# EasyEDA Pro project EPDSchedule.eprj

# Schematic Schematic1
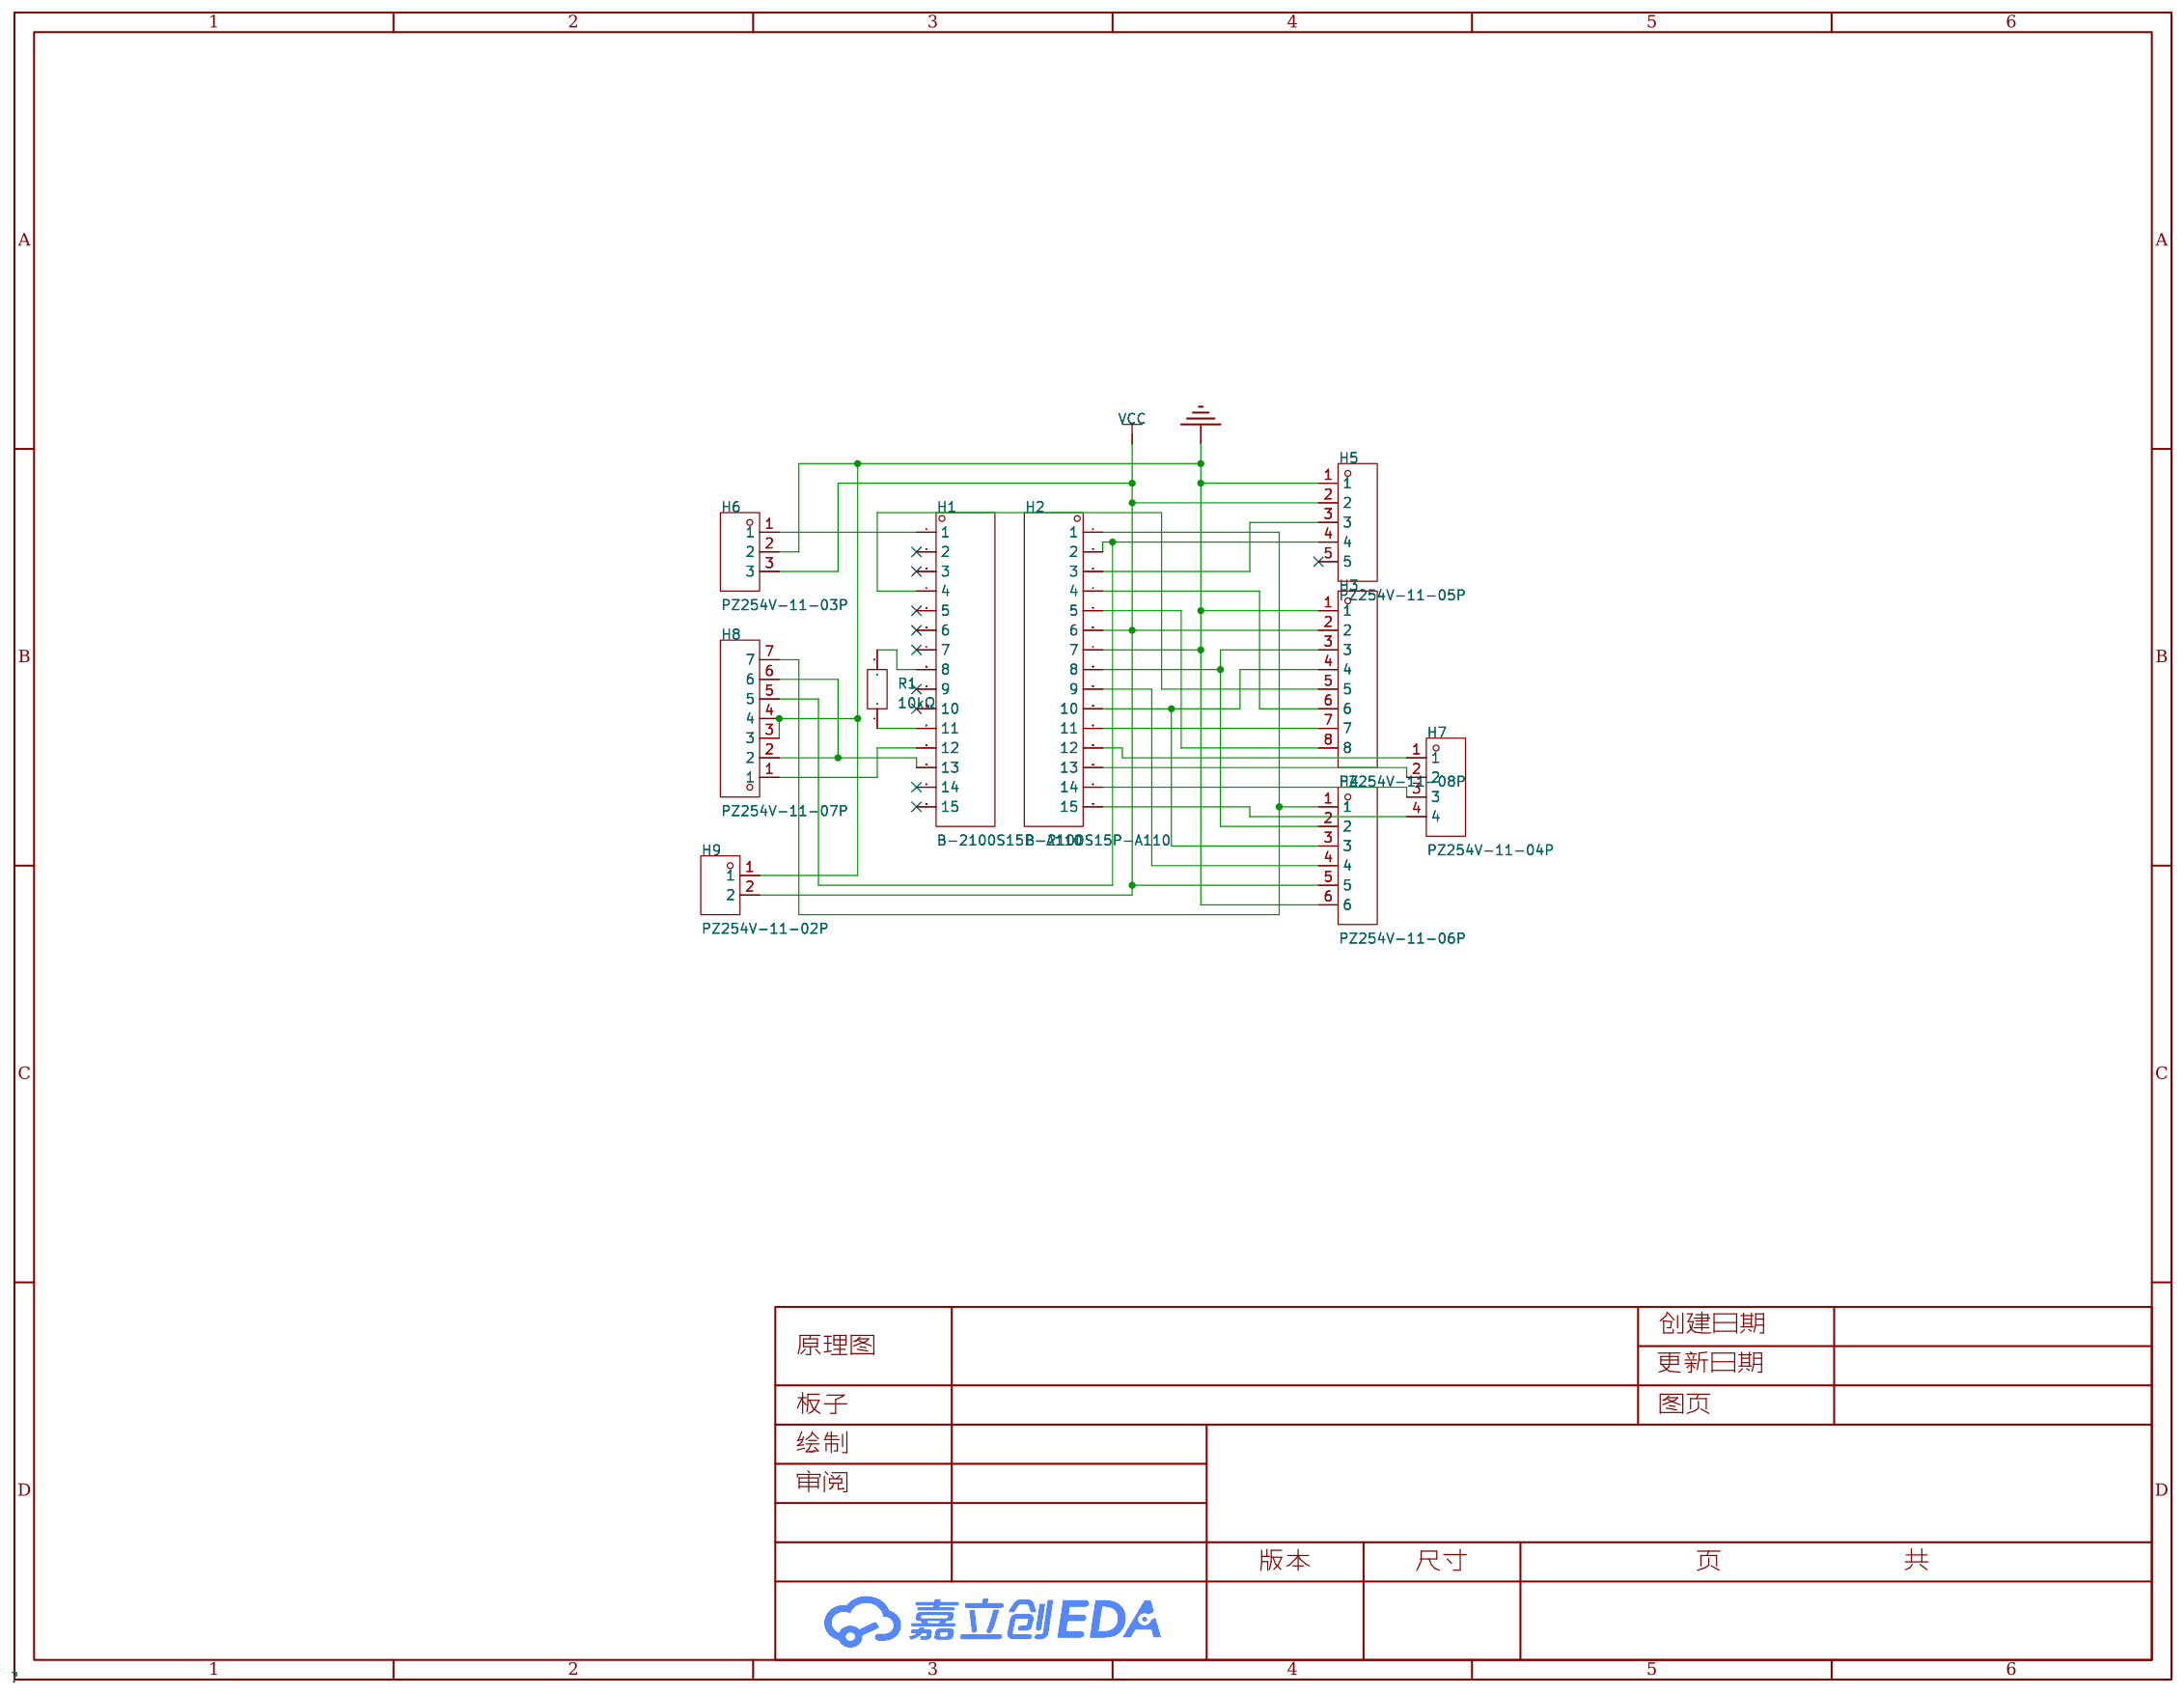
[diagram p0: schematic sheet]

## Parts
H1  B-2100S15P-A110  [HDR-TH_15P-P2.54-V-M]
H2  B-2100S15P-A110  [HDR-TH_15P-P2.54-V-M]
H3  PZ254V-11-08P  [HDR-TH_8P-P2.54-V-M]
H4  PZ254V-11-06P  [HDR-TH_6P-P2.54-V-M]
H5  PZ254V-11-05P  [HDR-TH_5P-P2.54-V-M]
H6  PZ254V-11-03P  [HDR-TH_3P-P2.54-V-M]
H7  PZ254V-11-04P  [HDR-TH_4P-P2.54-V-M]
H8  PZ254V-11-07P  [HDR-TH_7P-P2.54-V-M]
H9  PZ254V-11-02P  [HDR-TH_2P-P2.54-V-M]
R1  10kΩ  [RES-TH_BD2.4-L6.3-P10.30-D0.6]

## Library data of the parts
H1 H2 = B-2100S15P-A110: LCSC Part Name: 2.54mm 1x15P 直插; Supplier Part: C124373; Manufacturer: Ckmtw(灿科盟); Supplier Footprint: 插件,P=2.54mm; JLCPCB Part Class: Extended Part; Datasheet: https://atta.szlcsc.com/upload/public/pdf/source/20170821/C124373_1503303304753901525.pdf; Supplier: LCSC; Pitch: 2.54mm; Number of Pins: 15; Number of Rows: 1; Pin Structure: 1x15P; Mounting Type: 直插; Length of Mating Pin: 6mm; Insulation Height: 2.54mm; Length of End Connection Pin: 3mm; Contact Material: 黄铜; Operating Temperature Range: -40℃~+105℃; Color: 黑色
H3 = PZ254V-11-08P: LCSC Part Name: 2.54mm 1x8P 直插 方针; Supplier Part: C492407; Manufacturer: XFCN(兴飞); Supplier Footprint: 插件,P=2.54mm; JLCPCB Part Class: Extended Part; Datasheet: https://atta.szlcsc.com/upload/public/pdf/source/20200309/C492407_83A6FB26A2233368EDB9516968EC6149.pdf; Supplier: LCSC; Pitch: 2.54mm; Number of Pins: 8; Number of Rows: 1; Pin Structure: 1x8P; Mounting Type: 直插; Circluar Pins/Square Pins: 方针; Length of Mating Pin: 6mm; Insulation Height: 2.5mm; Length of End Connection Pin: 3mm; Contact Material: 黄铜; Operating Temperature Range: -40℃~+105℃; Color: 黑色
H4 = PZ254V-11-06P: LCSC Part Name: 间距:2.54mm 1x6P 直插 方针; Supplier Part: C492405; Manufacturer: XFCN(兴飞); Supplier Footprint: 插件,P=2.54mm; JLCPCB Part Class: 扩展库; Datasheet: https://atta.szlcsc.com/upload/public/pdf/source/20200309/C492405_597F1930F5B55CC3C7FD95458F1C3977.pdf; Supplier: LCSC; Pin Structure: 1x6P; Pitch: 2.54mm; Circluar Pins/Square Pins: 方针; Mounting Type: 直插; Number of Rows: 单排; Number of Pins: 6P; Length of Mating Pin: 6mm; Insulation Height: 2.5mm; Length of End Connection Pin: 3mm; Contact Material: 黄铜; Operating Temperature Range: -40℃~+105℃; Color: 黑色
H5 = PZ254V-11-05P: LCSC Part Name: 2.54mm 1x5P 直插 方针; Supplier Part: C492404; Manufacturer: XFCN(兴飞); Supplier Footprint: 直插,P=2.54mm; JLCPCB Part Class: Extended Part; Datasheet: https://atta.szlcsc.com/upload/public/pdf/source/20200309/C492404_E51533260F8710EFF5D4617281164C1D.pdf; Supplier: LCSC; Pitch: 2.54mm; Number of Pins: 5; Number of Rows: 1; Pin Structure: 1x5P; Mounting Type: 直插; Circluar Pins/Square Pins: 方针; Length of Mating Pin: 6mm; Insulation Height: 2.5mm; Length of End Connection Pin: 3mm; Contact Material: 黄铜; Operating Temperature Range: -40℃~+105℃; Color: 黑色
H6 = PZ254V-11-03P: LCSC Part Name: 2.54mm 1x3P 直插 方针; Supplier Part: C492402; Manufacturer: XFCN(兴飞); Supplier Footprint: 插件,P=2.54mm; JLCPCB Part Class: Extended Part; Datasheet: https://atta.szlcsc.com/upload/public/pdf/source/20200309/C492402_8335C3D49C4E4C618838D59BB1D024C1.pdf; Supplier: LCSC; Pitch: 2.54mm; Number of Pins: 3; Number of Rows: 1; Pin Structure: 1x3P; Mounting Type: 直插; Circluar Pins/Square Pins: 方针; Length of Mating Pin: 6mm; Insulation Height: 2.5mm; Length of End Connection Pin: 3mm; Contact Material: 黄铜; Operating Temperature Range: -40℃~+105℃; Color: 黑色
H7 = PZ254V-11-04P: LCSC Part Name: 间距:2.54mm 1x4P 直插 方针; Supplier Part: C2691448; Manufacturer: XFCN(兴飞); Supplier Footprint: 插件,P=2.54mm; JLCPCB Part Class: 扩展库; Datasheet: https://atta.szlcsc.com/upload/public/pdf/source/20200309/C492403_F9F19131791D08044AD4F84F8E751A34.pdf; Supplier: LCSC; Pin Structure: 1x4P; Pitch: 2.54mm; Circluar Pins/Square Pins: 方针; Mounting Type: 直插; Number of Rows: 单排; Number of Pins: 4P; Current Rating (Max): 3A; Voltage Rating (Max): 250V; Length of Mating Pin: 6mm; Insulation Height: 2.5mm; Length of End Connection Pin: 3mm; Operating Temperature Range: -40℃~+105℃; Color: 黑色
H8 = PZ254V-11-07P: LCSC Part Name: 2.54mm 1x7P 直插 方针; Supplier Part: C492406; Manufacturer: XFCN(兴飞); Supplier Footprint: 直插,P=2.54mm; JLCPCB Part Class: Extended Part; Datasheet: https://atta.szlcsc.com/upload/public/pdf/source/20200309/C492406_654C533EE691117E22DD9F76C114C2D9.pdf; Supplier: LCSC; Pitch: 2.54mm; Number of Pins: 7; Number of Rows: 1; Pin Structure: 1x7P; Mounting Type: 直插; Circluar Pins/Square Pins: 方针; Length of Mating Pin: 6mm; Insulation Height: 2.5mm; Length of End Connection Pin: 3mm; Contact Material: 黄铜; Operating Temperature Range: -40℃~+105℃; Color: 黑色
H9 = PZ254V-11-02P: LCSC Part Name: 间距:2.54mm 1x2P 直插 方针; Supplier Part: C492401; Manufacturer: XFCN(兴飞); Supplier Footprint: 插件,P=2.54mm; JLCPCB Part Class: 扩展库; Datasheet: https://atta.szlcsc.com/upload/public/pdf/source/20200309/C492401_A812433581A9B211A7FFA413ADDFF0E5.pdf; Supplier: LCSC; Pin Structure: 1x2P; Pitch: 2.54mm; Circluar Pins/Square Pins: 方针; Mounting Type: 直插; Number of Rows: 单排; Number of Pins: 2P; Length of Mating Pin: 6mm; Insulation Height: 2.5mm; Length of End Connection Pin: 3mm; Contact Material: 黄铜; Operating Temperature Range: -40℃~+105℃; Color: 黑色
R1 = RN1/4W10KFT/BA1: LCSC Part Name: 10kΩ ±1% 250mW 金属膜电阻; Supplier Part: C410695; Manufacturer: Tyohm(幸亚电阻); Supplier Footprint: 插件,D2.4xL6.5mm; JLCPCB Part Class: 扩展库; Datasheet: https://atta.szlcsc.com/upload/public/pdf/source/20190808/C410699_D126E64D28B638F1D73B58E9F61DFD9B.pdf; Supplier: LCSC; Type: 金属膜电阻; Tolerance: ±1%; Overload Voltage (Max): 250V; Power(Watts): 250mW; Temperature Coefficient: ±50ppm/℃; Operating Temperature Range: -55℃~+125℃

## Nets
GND: H2.7 H3.1 H4.6 H5.1 H6.2 H8.3 H8.4 H9.1
VCC: H2.6 H3.2 H4.5 H5.2 H6.3 H9.2
$1N870: H1.1 H6.1
$1N1333: H2.3 H5.3
$1N1339: H2.2 H5.4 H8.5
$1N1392: H2.8 H3.3 H4.2
$1N1398: H2.10 H3.4 H4.3
$1N1417: H1.4 H3.5
$1N1423: H2.4 H3.6
$1N1437: H2.11 H3.7
$1N1441: H2.5 H3.8
$1N1492: H2.9 H4.4
$1N1542: H2.1 H4.1 H8.7
$1N1650: H2.12 H7.1
$1N1656: H2.13 H7.2
$1N1669: H2.15 H7.4
$1N1864: H1.13 H8.2 H8.6
$1N1987: H1.8 R1.2
$1N1996: H1.11 R1.1
$1N2072: H1.12 H8.1
Net-(H2-14): H2.14 H7.3

Not connected (* = marked no-connect by the designer): H1 2* 3* 5* 6* 7* 9* 10* 14* 15*; H5 5*

# Board PCB1
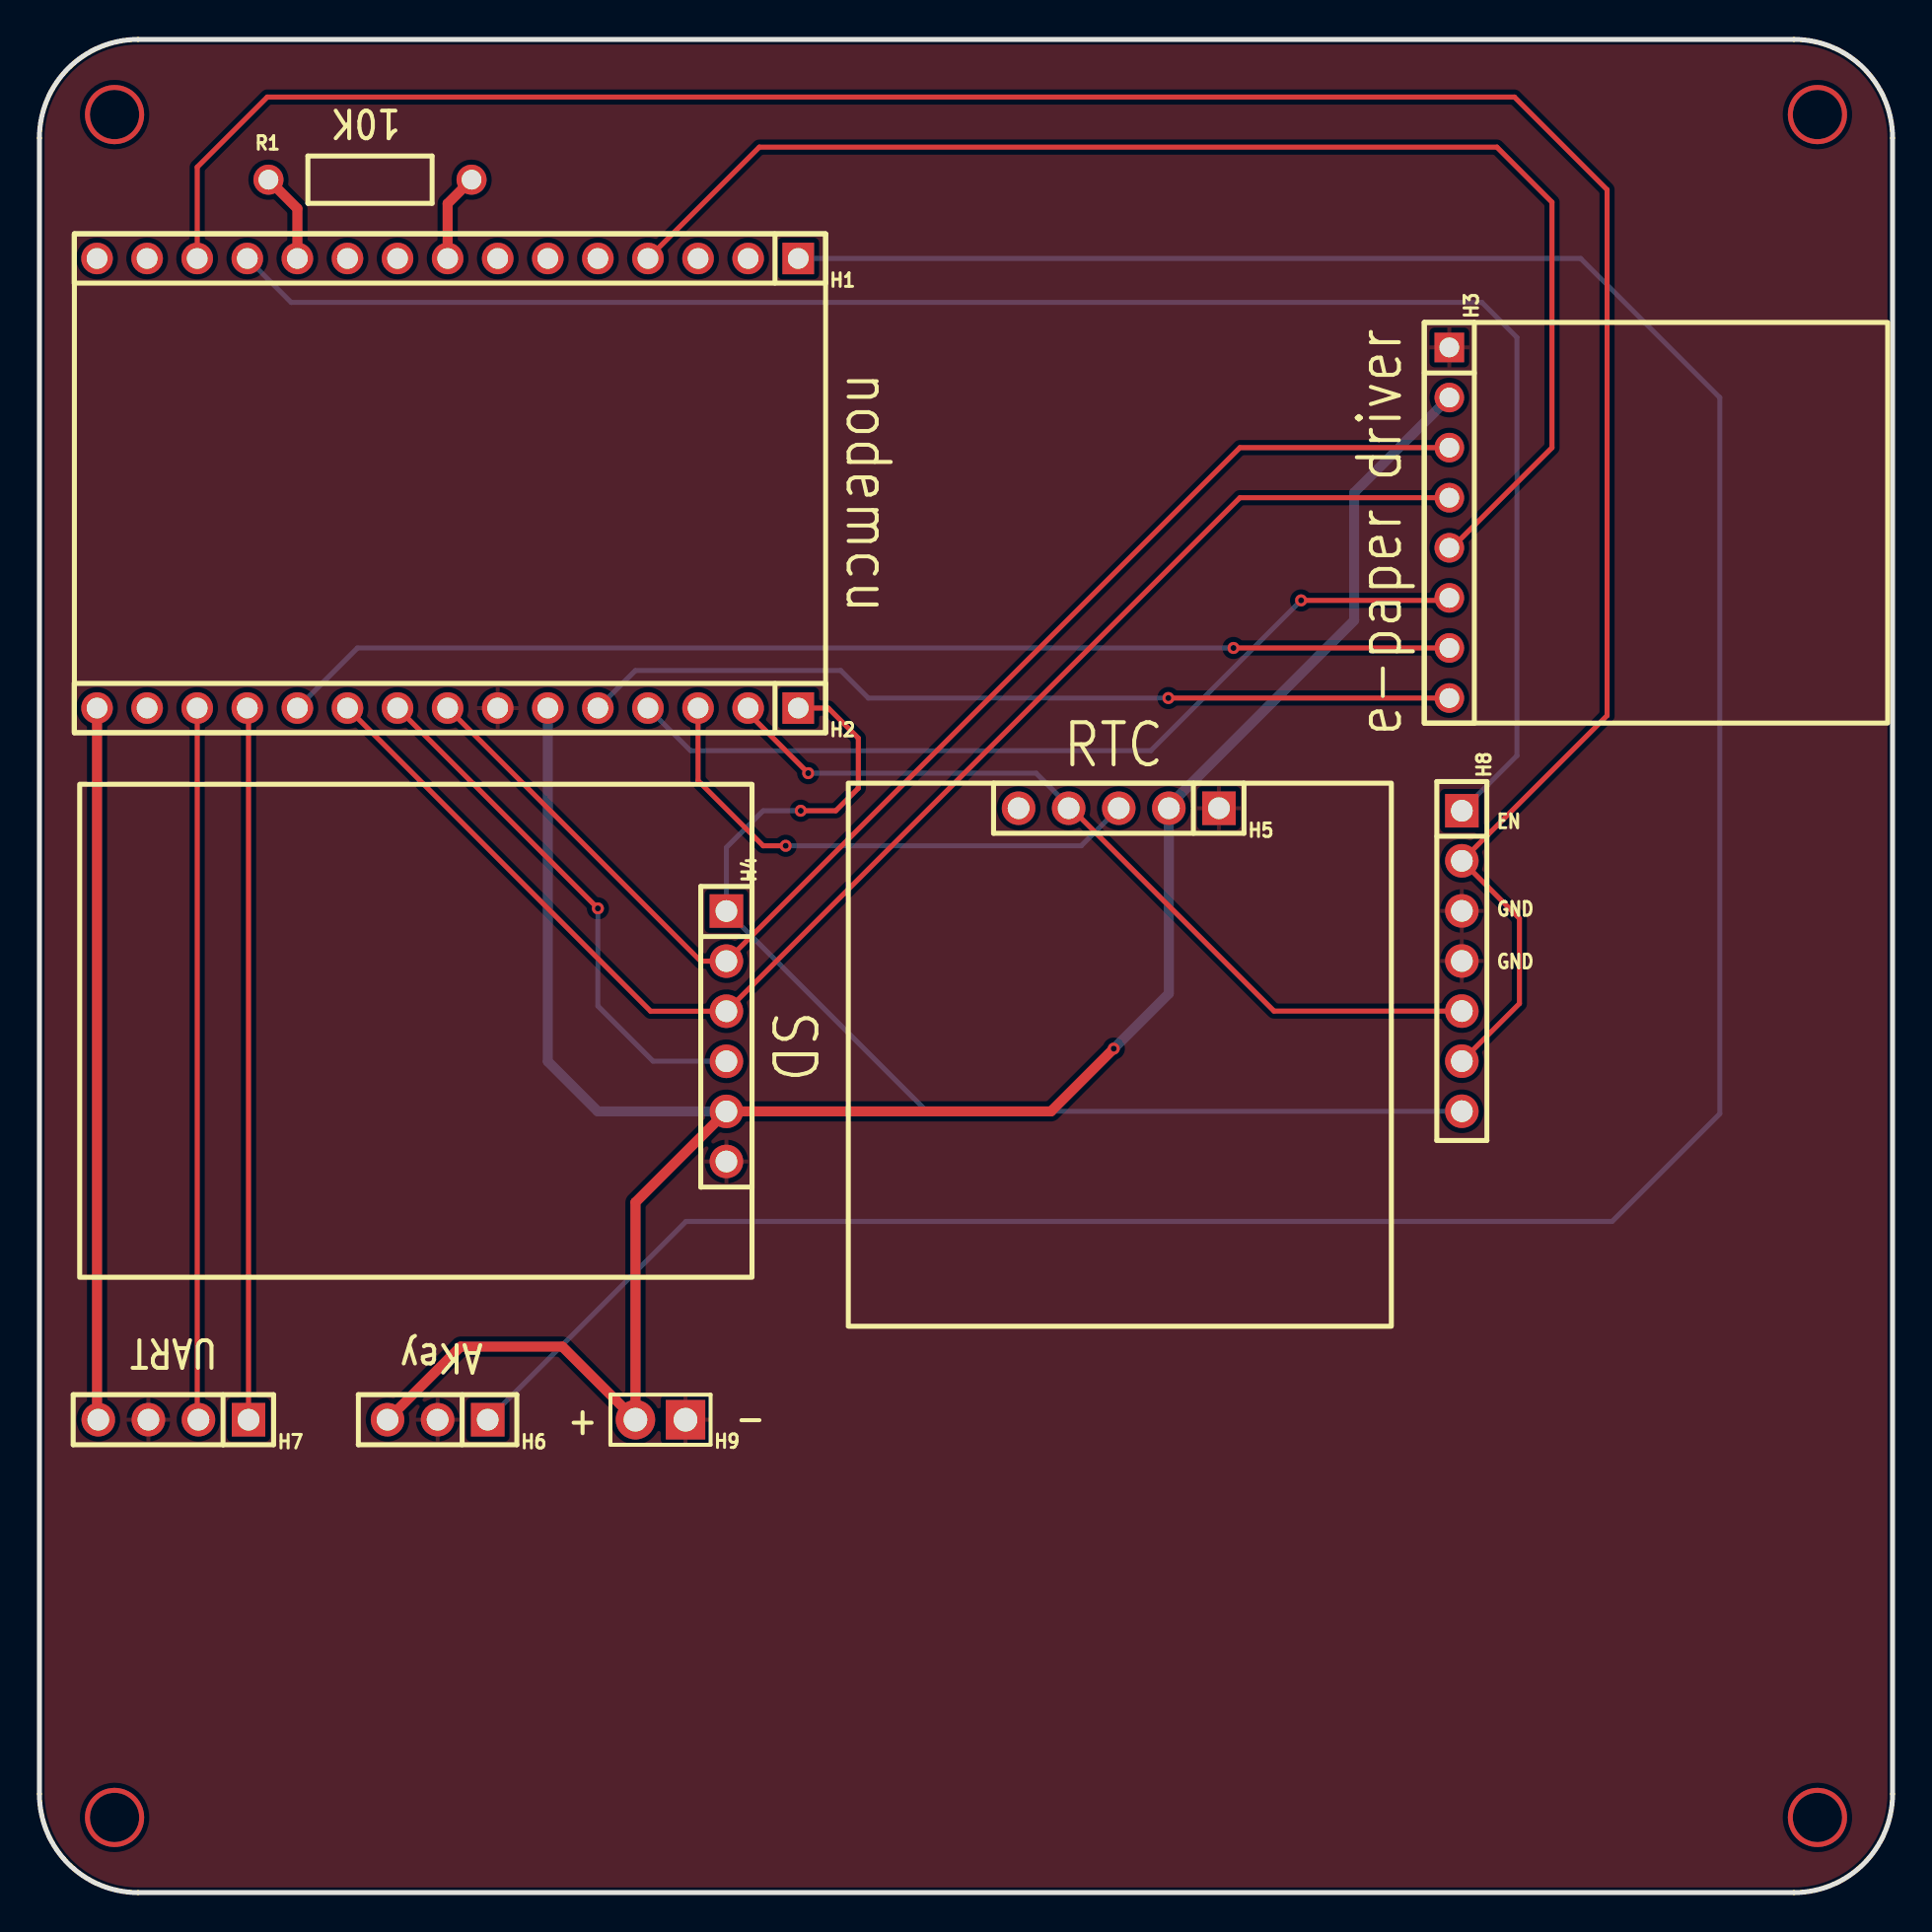
[diagram p1: board, top side]
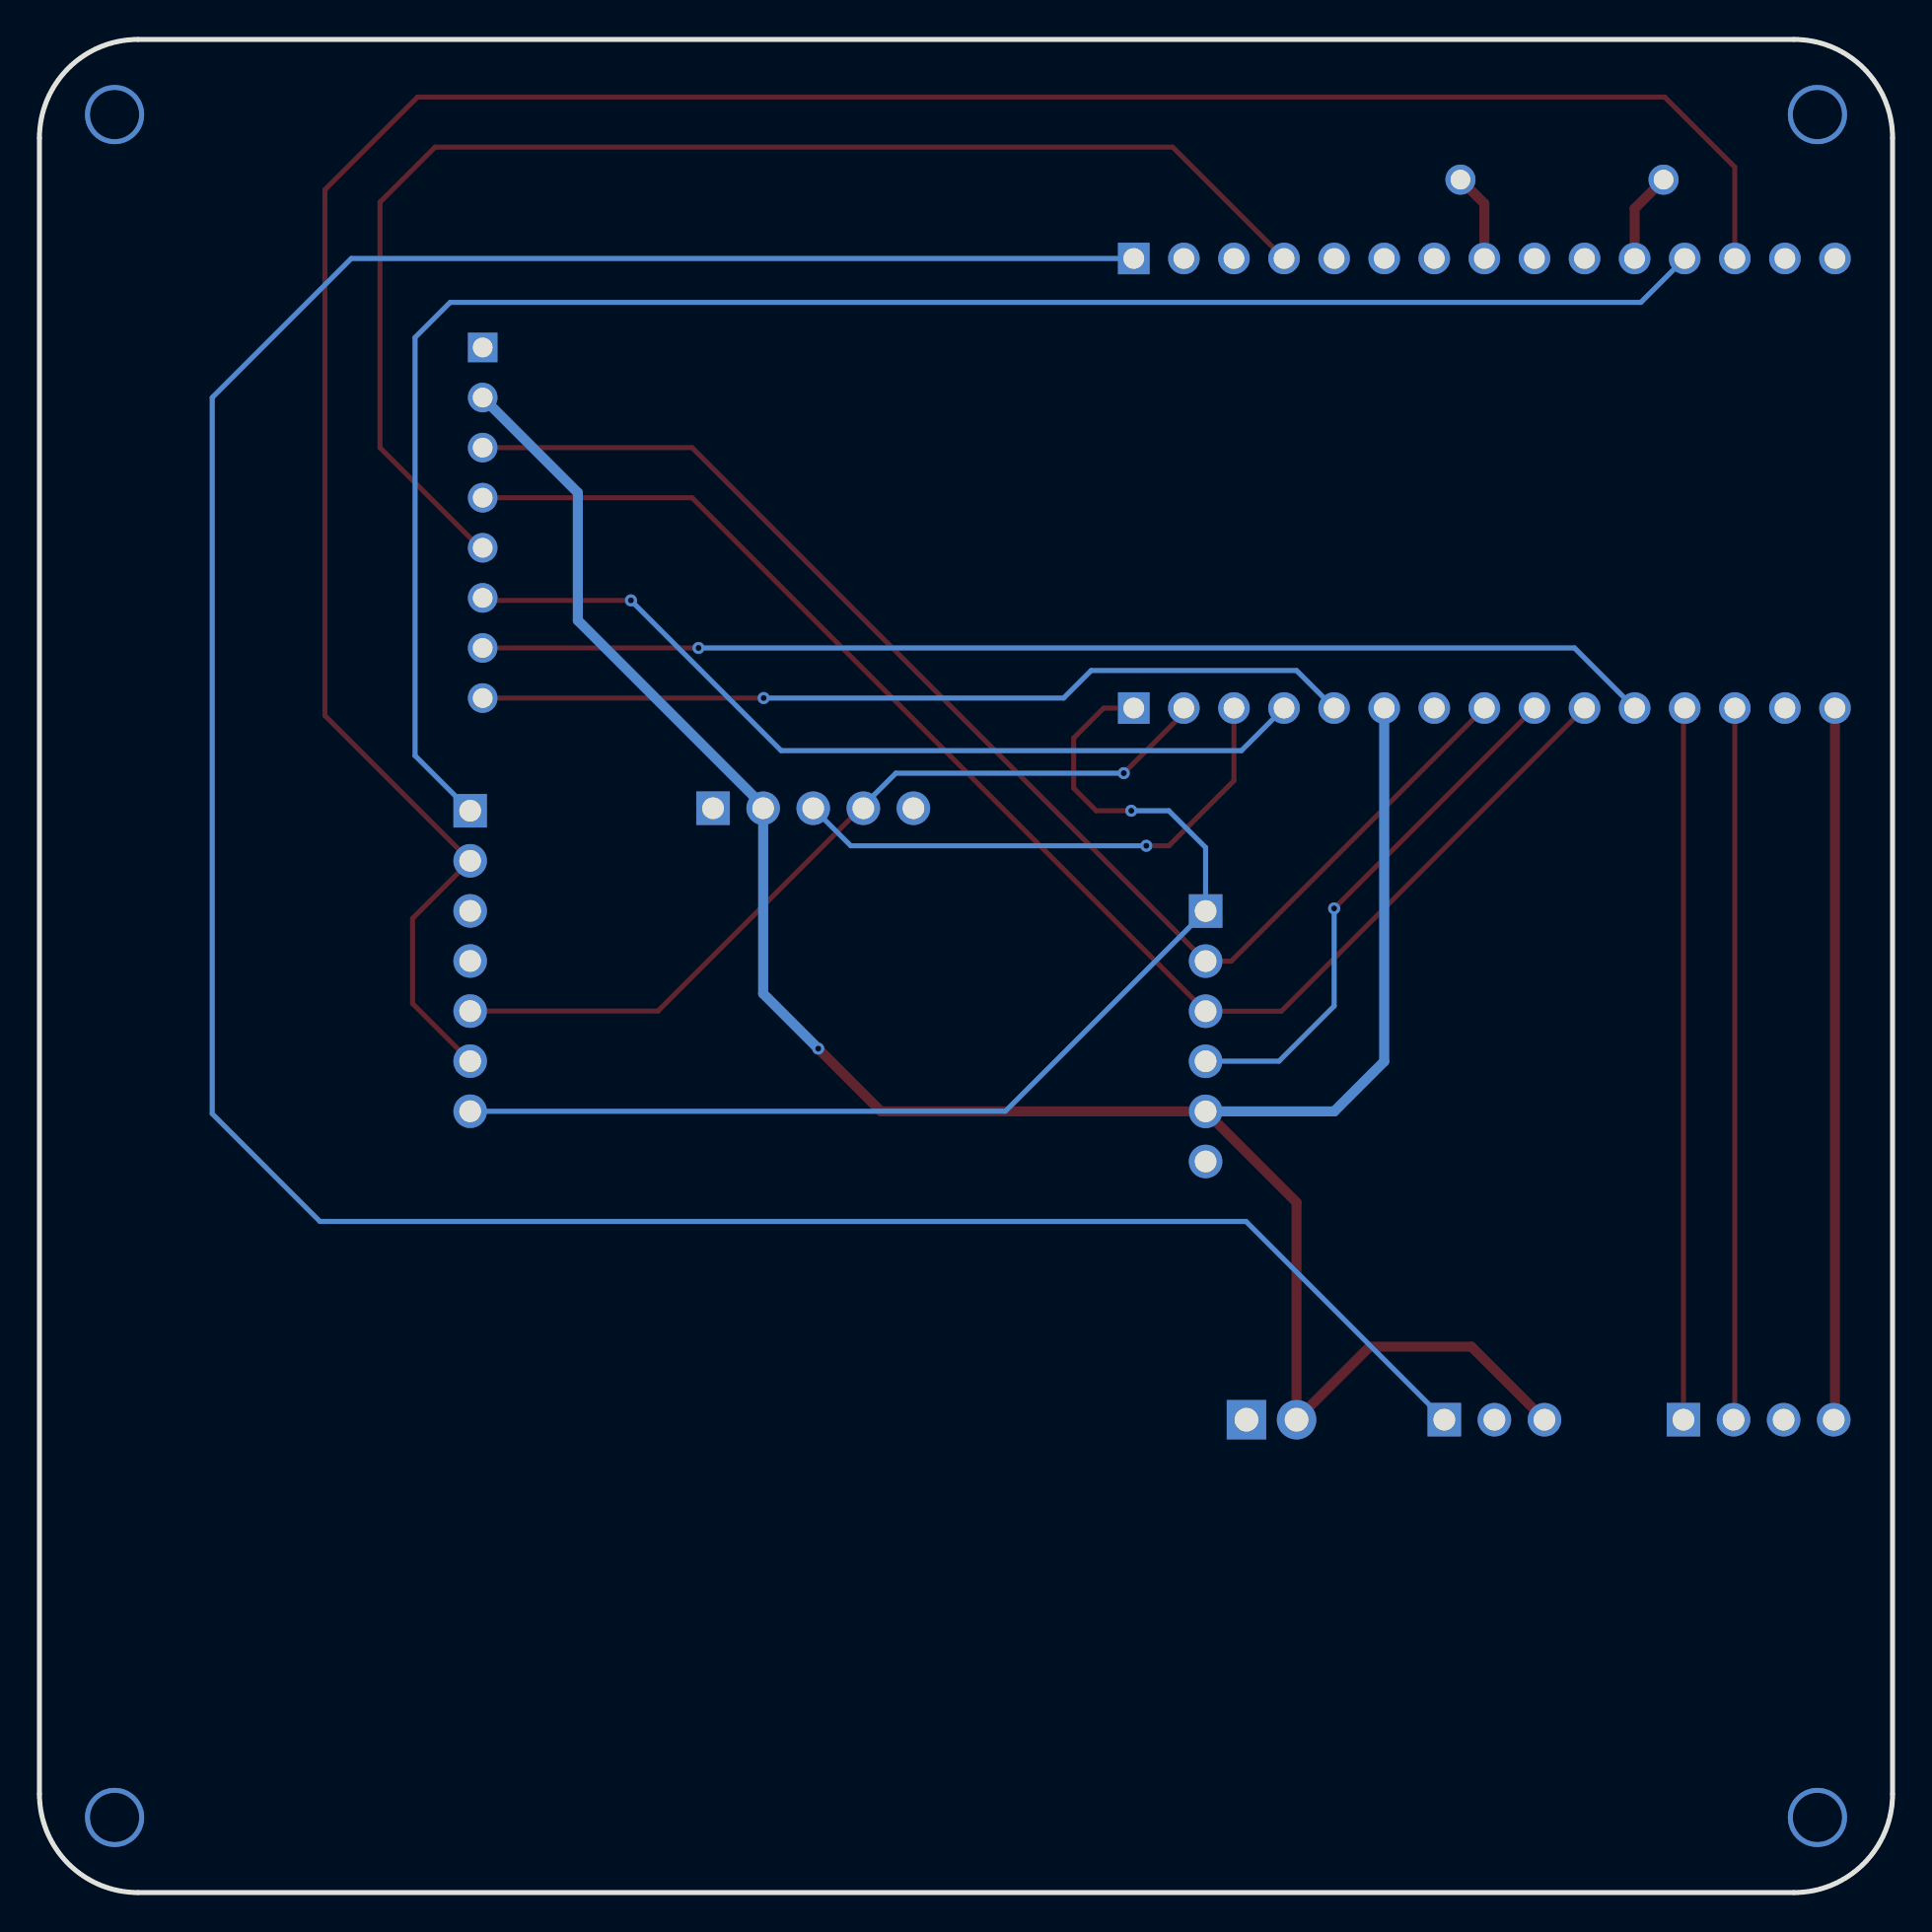
[diagram p2: board, bottom side, seen from below]

Outline 93.98 x 93.98 mm; copper layers: Top Layer, Bottom Layer. Coordinates in mm from the lower left corner of the outline.
Outline path: 0,88.98 0,5 arc(1.46,1.46) 5,0 88.98,0 arc(92.52,1.46) 93.98,5 93.98,88.98 arc(92.52,92.52) 88.98,93.98 5,93.98 arc(1.46,92.52) 0,88.98
Stack: Top Layer 0.035mm / Dielectric1 1.51mm FR4 er 4.5 / Bottom Layer 0.035mm

## Design rules (mm)
template: JLCPCB Capability(Two Layers Board)
spacing copperThickness1oz (default): track to track 0.102, other pairs 0.152 to 0.3
spacing copperThickness2oz: track to track 0.203, other pairs 0.152 to 0.3
track width copperThickness1oz (default): min 0.127, default 0.254, max 2.54
track width copperThickness2oz: min 0.203, default 0.254, max 2.54
differential pair differentialPair (default): width min 0.127, default 0.254, max 2.54; gap min 0.152, default 0.152
via viaSize (default): diameter min 0.5, default 0.61, max 10; hole min 0.3, default 0.305, max 6.3

## Placement (name value [footprint] x y rotation side)
H1  B-2100S15P-A110  [HDR-TH_15P-P2.54-V-M]  20.7 82.87 180 top
H2  B-2100S15P-A110  [HDR-TH_15P-P2.54-V-M]  20.7 60.07 180 top
H3  PZ254V-11-08P  [HDR-TH_8P-P2.54-V-M]  71.5 69.47 270 top
H4  PZ254V-11-06P  [HDR-TH_6P-P2.54-V-M]  34.84 43.43 270 top
H5  PZ254V-11-05P  [HDR-TH_5P-P2.54-V-M]  54.74 54.99 180 top
H6  PZ254V-11-03P  [HDR-TH_3P-P2.54-V-M]  20.19 23.98 180 top
H7  PZ254V-11-04P  [HDR-TH_4P-P2.54-V-M]  6.79 23.98 180 top
H8  PZ254V-11-07P  [HDR-TH_7P-P2.54-V-M]  72.14 47.24 270 top
H9  PZ254V-11-02P  [HDR-TH_2P-P2.54-V-M]  31.5 23.98 180 top
R1  10kΩ  [RES-TH_BD2.4-L6.3-P10.30-D0.6]  16.76 86.87 0 top

## Footprints (pads in the part's own frame, mm; a bottom-side part is the same pattern mirrored in y, then rotated)
HDR-TH_2P-P2.54-V-M
  rect 2x2 hole 1.2: 1(-1.27,0)
  round 2 hole 1.2: 2(1.27,0)
HDR-TH_3P-P2.54-V-M
  rect 1.7x1.7 hole 1.1: 1(-2.54,0)
  round 1.7 hole 1.1: 2(0,0) 3(2.54,0)
HDR-TH_4P-P2.54-V-M
  rect 1.7x1.7 hole 1.1: 1(-3.81,0)
  round 1.7 hole 1.1: 2(-1.27,0) 3(1.27,0) 4(3.81,0)
HDR-TH_5P-P2.54-V-M
  rect 1.7x1.7 hole 1.1: 1(-5.08,0)
  round 1.7 hole 1.1: 2(-2.54,0) 3(0,0) 4(2.54,0) 5(5.08,0)
HDR-TH_6P-P2.54-V-M
  rect 1.7x1.7 hole 1.1: 1(-6.35,0)
  round 1.7 hole 1.1: 2(-3.81,0) 3(-1.27,0) 4(1.27,0) 5(3.81,0) 6(6.35,0)
HDR-TH_7P-P2.54-V-M
  rect 1.7x1.7 hole 1.1: 1(-7.62,0)
  round 1.7 hole 1.1: 2(-5.08,0) 3(-2.54,0) 4(0,0) 5(2.54,0) 6(5.08,0) 7(7.62,0)
HDR-TH_8P-P2.54-V-M
  rect 1.5x1.5 hole 1: 1(-8.89,0)
  round 1.5 hole 1: 2(-6.35,0) 3(-3.81,0) 4(-1.27,0) 5(1.27,0) 6(3.81,0) 7(6.35,0) 8(8.89,0)
HDR-TH_15P-P2.54-V-M
  rect 1.6x1.6 hole 1.05: 1(-17.78,0)
  round 1.6 hole 1.05: 2(-15.24,0) 3(-12.7,0) 4(-10.16,0) 5(-7.62,0) 6(-5.08,0) 7(-2.54,0) 8(0,0) 9(2.54,0) 10(5.08,0) 11(7.62,0) 12(10.16,0) 13(12.7,0) 14(15.24,0) 15(17.78,0)
RES-TH_BD2.4-L6.3-P10.30-D0.6
  round 1.524 hole 1: 1(-5.15,0) 2(5.15,0)

## Nets
As in the schematic, except:
GND: H2.7 H3.1 H4.6 H5.1 H6.2 H7.3 H8.3 H8.4 H9.1

Pads without a net: H1 2 3 5 6 7 9 10 14 15; H5 5

## Via types
v1: diameter 3, hole 2.5, Top Layer to Bottom Layer, 4 vias
v2: diameter 0.61, hole 0.305, Top Layer to Bottom Layer, 8 vias

## Routing (per net, layer and track width the routed paths; a pad name or vN(x,y) marks a point on that pad's centre or on a via; arc(x,y) is an arc through that point)
VCC: length 122.3
  Top Layer w0.508: v2(54.48,42.8) 51.3,39.62 H4.5 30.23,35 H9.2 26.52,27.69 21.36,27.69 H6.3
  Bottom Layer w0.508: H3.2 66.68,70.99 66.68,64.52 57.28,55.12 57.28,45.59 v2(54.48,42.8) ; H4.5 28.31,39.62 25.78,42.15 H2.6
(no net):
  vias: v1(3.81,90.17) v1(3.81,3.81) v1(90.17,90.17) v1(90.17,3.81)
$1N870: length 154.9
  Bottom Layer w0.254: H1.1 78.16,82.87 85.22,75.82 85.22,39.5 79.76,34.04 32.79,34.04 H6.1
$1N1333: length 27.2
  Top Layer w0.254: H2.3 33.4,56.39 36.7,53.09 v2(37.85,53.09)
  Bottom Layer w0.254: v2(37.85,53.09) 52.83,53.09 H5.3
$1N1339: length 42.7
  Top Layer w0.254: v2(38.99,56.77) 35.94,59.82 H2.2 ; H8.5 62.61,44.7 52.2,55.12
  Bottom Layer w0.254: v2(38.99,56.77) 50.55,56.77 52.2,55.12
$1N1392: length 66.9
  Top Layer w0.254: H3.3 60.88,73.28 H4.2 33.53,47.24 H2.8
$1N1398: length 73
  Top Layer w0.254: H3.4 60.88,70.74 H4.3 31,44.7 H2.10
$1N1417: length 69.1
  Top Layer w0.254: H3.5 71.63,68.2 76.71,73.28 76.71,85.72 73.91,88.52 36.51,88.52 H1.4
$1N1423: length 44.7
  Top Layer w0.254: v2(63.98,65.53) 71.37,65.53 H3.6
  Bottom Layer w0.254: H2.4 33.02,57.91 56.36,57.91 v2(63.98,65.53)
$1N1437: length 59.7
  Top Layer w0.254: H3.7 v2(60.56,63.12)
  Bottom Layer w0.254: H2.11 16.13,63.12 v2(60.56,63.12)
$1N1441: length 44.5
  Top Layer w0.254: H3.8 v2(57.25,60.58)
  Bottom Layer w0.254: H2.5 30.23,61.98 40.64,61.98 42.04,60.58 v2(57.25,60.58)
$1N1492: length 27.4
  Top Layer w0.254: v2(28.32,49.91) H2.9
  Bottom Layer w0.254: 35.09,42.41 34.85,42.16 31.12,42.16 28.32,44.96 v2(28.32,49.91)
$1N1542: length 58.9
  Top Layer w0.254: v2(38.61,54.86) 40.39,54.86 41.53,56.01 41.53,58.55 40,60.07 H2.1
  Bottom Layer w0.254: v2(38.61,54.86) 36.7,54.86 34.84,53 H4.1 44.99,39.62 H8.7
$1N1650: length 36.1
  Top Layer w0.254: H2.12 10.6,60.01 H7.1
$1N1656: length 36.1
  Top Layer w0.254: H2.13 8,24.04 H7.2
$1N1669: length 36.1
  Top Layer w0.508: H7.4 2.92,24.04 H2.15
$1N1864: length 129.2
  Top Layer w0.254: H8.6 75.06,45.08 75.06,49.4 H8.2 79.5,59.69 79.5,86.36 74.8,91.06 11.56,91.06 8,87.5 H1.13
$1N1987: length 4.5
  Top Layer w0.508: H1.8 20.7,85.65 R1.2
$1N1996: length 4.6
  Top Layer w0.508: H1.11 13.08,85.4 R1.1
$1N2072: length 91.2
  Bottom Layer w0.254: H8.1 74.93,57.66 74.93,78.87 73.15,80.64 12.77,80.64 H1.12

## Copper pours and planes (outline as drawn; the poured copper is in the pictures)
GND on Top Layer: 0,93.98 93.98,93.98 93.98,0 0,0

## Text on the board
Top Silkscreen Layer: EN | GND | + | - | UART | 10K | AKey | RTC | SD | nodemcu | e-paper driver
